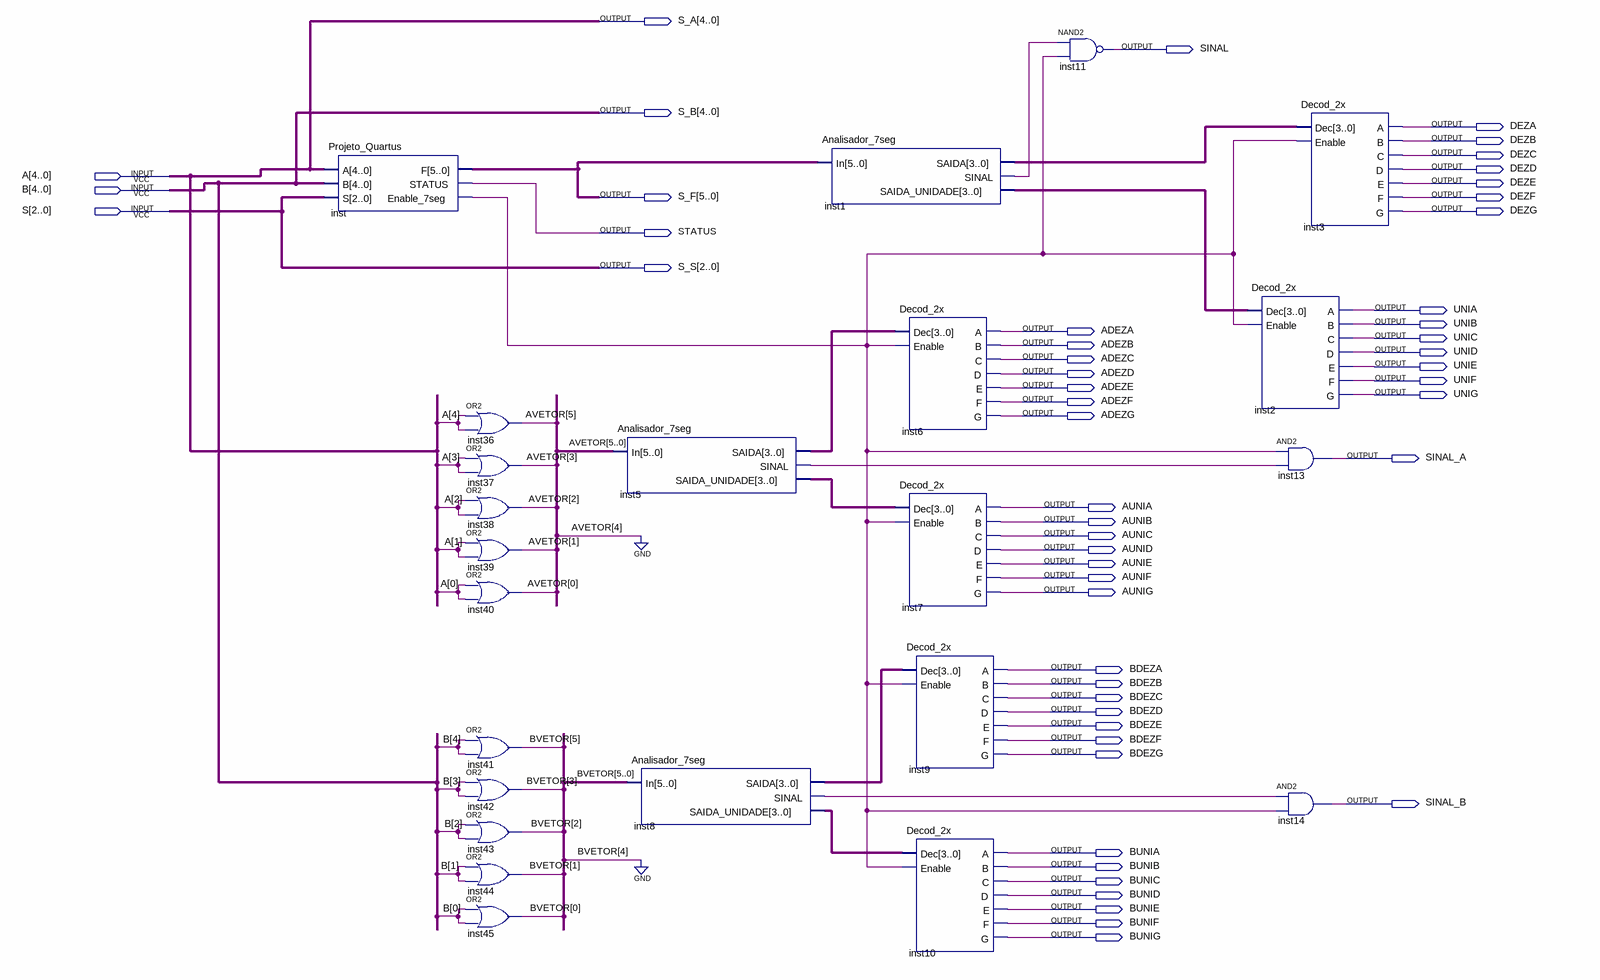
[diagram p0: schematic sheet]
// Quartus schematic Main.bdf as structural Verilog: 23 symbols, 53 pins
module Main (
  input  [4:0] A,
  input  [4:0] B,
  input  [2:0] S,
  output [4:0] S_A,
  output SINAL,
  output [4:0] S_B,
  output DEZA,
  output DEZB,
  output DEZC,
  output DEZD,
  output DEZE,
  output [5:0] S_F,
  output DEZF,
  output DEZG,
  output STATUS,
  output [2:0] S_S,
  output UNIA,
  output UNIB,
  output ADEZA,
  output UNIC,
  output ADEZB,
  output UNID,
  output ADEZC,
  output UNIE,
  output ADEZD,
  output UNIF,
  output ADEZE,
  output UNIG,
  output ADEZF,
  output ADEZG,
  output SINAL_A,
  output AUNIA,
  output AUNIB,
  output AUNIC,
  output AUNID,
  output AUNIE,
  output AUNIF,
  output AUNIG,
  output BDEZA,
  output BDEZB,
  output BDEZC,
  output BDEZD,
  output BDEZE,
  output BDEZF,
  output BDEZG,
  output SINAL_B,
  output BUNIA,
  output BUNIB,
  output BUNIC,
  output BUNID,
  output BUNIE,
  output BUNIF,
  output BUNIG
);

  wire inst1_sinal, inst5_sinal, inst8_sinal, inst_enable_7seg;
  wire [3:0] inst1_saida, inst1_saida_unidade, inst5_saida, inst5_saida_unidade, inst8_saida,
       inst8_saida_unidade;
  wire [5:0] AVETOR, BVETOR;

  Projeto_Quartus inst (.A(A), .B(B), .S(S), .F(S_F), .STATUS(STATUS), .Enable_7seg(inst_enable_7seg));
  or inst36 (AVETOR[5], A[4], A[4]);
  or inst37 (AVETOR[3], A[3], A[3]);
  or inst38 (AVETOR[2], A[2], A[2]);
  or inst39 (AVETOR[1], A[1], A[1]);
  or inst40 (AVETOR[0], A[0], A[0]);
  or inst41 (BVETOR[5], B[4], B[4]);
  or inst42 (BVETOR[3], B[3], B[3]);
  or inst43 (BVETOR[2], B[2], B[2]);
  or inst44 (BVETOR[1], B[1], B[1]);
  or inst45 (BVETOR[0], B[0], B[0]);
  Analisador_7seg inst5 (
    .In({AVETOR[5], 1'b0, AVETOR[3:0]}), .SAIDA(inst5_saida), .SINAL(inst5_sinal),
    .SAIDA_UNIDADE(inst5_saida_unidade));
  Analisador_7seg inst8 (
    .In({BVETOR[5], 1'b0, BVETOR[3:0]}), .SAIDA(inst8_saida), .SINAL(inst8_sinal),
    .SAIDA_UNIDADE(inst8_saida_unidade));
  Analisador_7seg inst1 (.In(S_F), .SAIDA(inst1_saida), .SINAL(inst1_sinal), .SAIDA_UNIDADE(inst1_saida_unidade));
  Decod_2x inst6 (
    .Dec(inst5_saida), .Enable(inst_enable_7seg), .A(ADEZA), .B(ADEZB), .C(ADEZC), .D(ADEZD), .E(ADEZE),
    .F(ADEZF), .G(ADEZG));
  Decod_2x inst7 (
    .Dec(inst5_saida_unidade), .Enable(inst_enable_7seg), .A(AUNIA), .B(AUNIB), .C(AUNIC), .D(AUNID),
    .E(AUNIE), .F(AUNIF), .G(AUNIG));
  Decod_2x inst9 (
    .Dec(inst8_saida), .Enable(inst_enable_7seg), .A(BDEZA), .B(BDEZB), .C(BDEZC), .D(BDEZD), .E(BDEZE),
    .F(BDEZF), .G(BDEZG));
  Decod_2x inst10 (
    .Dec(inst8_saida_unidade), .Enable(inst_enable_7seg), .A(BUNIA), .B(BUNIB), .C(BUNIC), .D(BUNID),
    .E(BUNIE), .F(BUNIF), .G(BUNIG));
  nand inst11 (SINAL, inst1_sinal, inst_enable_7seg);
  Decod_2x inst2 (
    .Dec(inst1_saida_unidade), .Enable(inst_enable_7seg), .A(UNIA), .B(UNIB), .C(UNIC), .D(UNID), .E(UNIE),
    .F(UNIF), .G(UNIG));
  Decod_2x inst3 (
    .Dec(inst1_saida), .Enable(inst_enable_7seg), .A(DEZA), .B(DEZB), .C(DEZC), .D(DEZD), .E(DEZE), .F(DEZF),
    .G(DEZG));
  and inst13 (SINAL_A, inst_enable_7seg, inst5_sinal);
  and inst14 (SINAL_B, inst8_sinal, inst_enable_7seg);

  assign S_A = A;
  assign S_B = B;
  assign S_S = S;
endmodule
